# Altium schematic sheet Speisung.SchDoc: Speisung
size A4; Author: bweina; CompanyName: ICT Bbc AG; DrawnBy: bweina; Engineer: bweina; Revision: 1.0.0; SheetNumber: 2; SheetTotal: 5
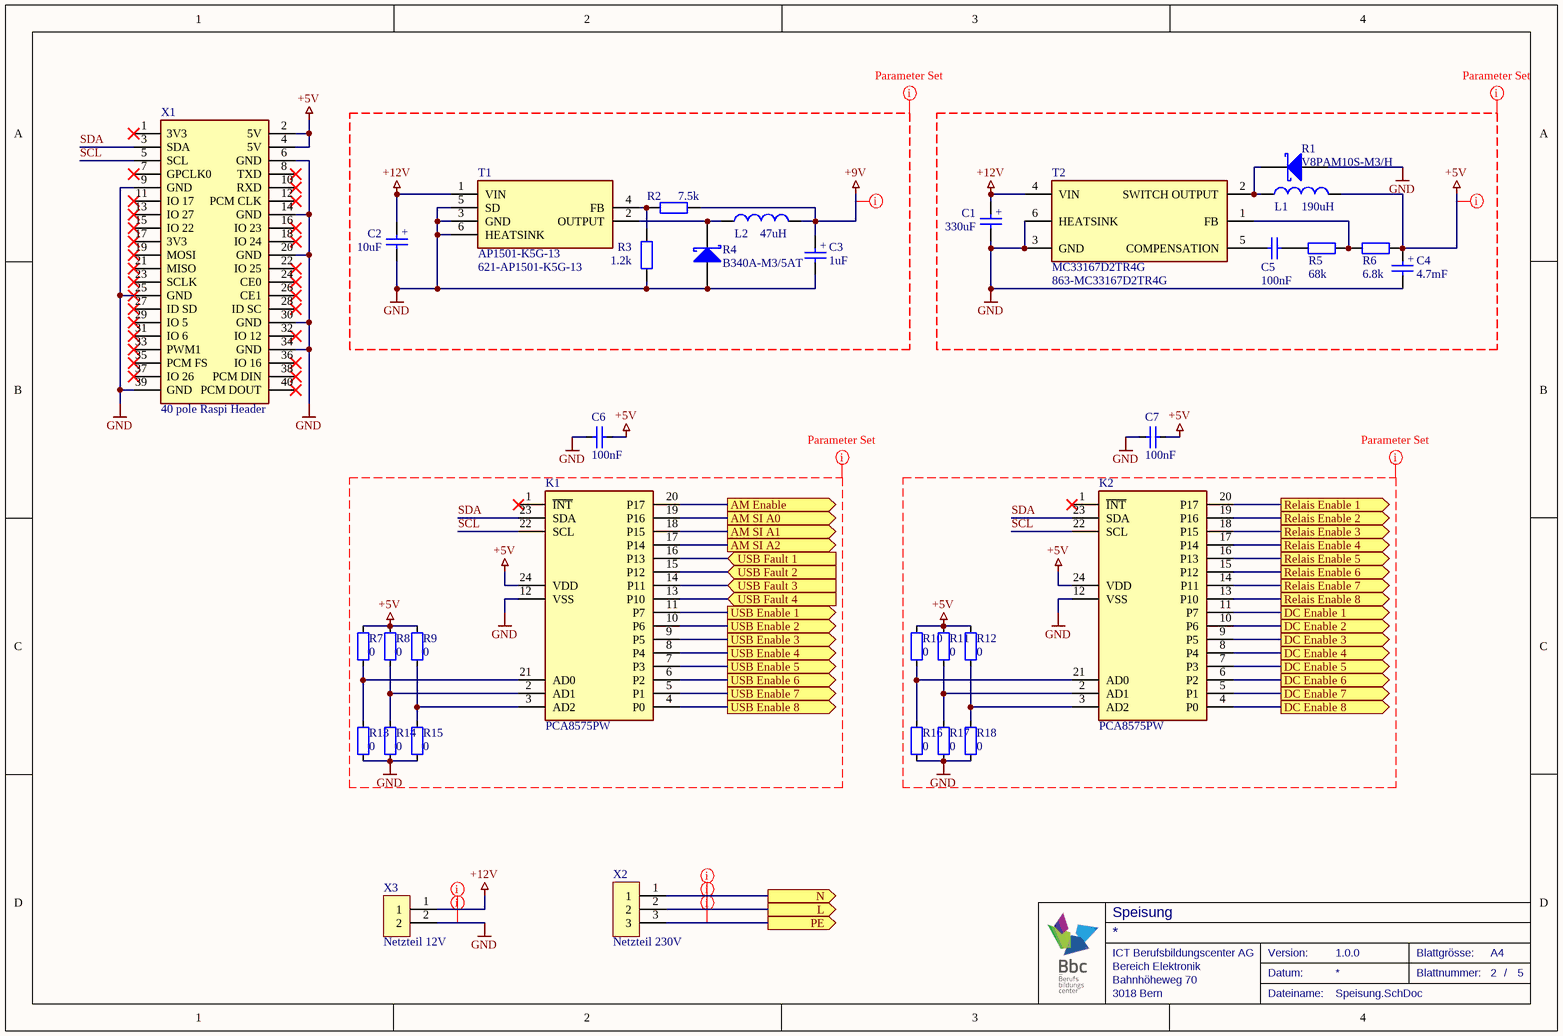
[diagram p0: Speisung.SchDoc]

## Parts
C1  value 330uF  [T521X337M016ATE015]  (hidden comment: Capacitor)
C2  value 10uF  [CAP TAN A R]  (hidden comment: Capacitor)
C3  value 1uF  [R82EC4100Z370J]  (hidden comment: Capacitor)
C4  value 4.7mF  [CAP ELKO 12.5x20x5 S]  (hidden comment: Capacitor)
C5  value 100nF  [CAP CER 1206 H]  (hidden comment: Capacitor)
C6  value 100nF  [CAP CER 0805 R]  (hidden comment: Capacitor)
C7  value 100nF  [CAP CER 0805 R]  (hidden comment: Capacitor)
K1  PCA8575PW  [TSOP65P640X110-24M]
K2  PCA8575PW  [TSOP65P640X110-24M]
L1  value 190uH  [SHBC14-1R2A0187V]  (hidden comment: Inductor)
L2  value 47uH  [SRP1038C6R8M]  (hidden comment: Inductor)
R1  V8PAM10S-M3/H  [DO-221BC]
R2  value 7.5k  [RESMELF3514N]  (hidden comment: Resistor)
R3  value 1.2k  [RESMELF3514N]  (hidden comment: Resistor)
R4  B340A-M3/5AT  [DO-214AC]
R5  value 68k  [RESMELF3514N]  (hidden comment: Resistor)
R6  value 6.8k  [RESMELF3514N]  (hidden comment: Resistor)
R7  value 0  [RES 1206 H]  (hidden comment: Resistor)
R8  value 0  [RES 1206 H]  (hidden comment: Resistor)
R9  value 0  [RES 1206 H]  (hidden comment: Resistor)
R10  value 0  [RES 1206 H]  (hidden comment: Resistor)
R11  value 0  [RES 1206 H]  (hidden comment: Resistor)
R12  value 0  [RES 1206 H]  (hidden comment: Resistor)
R13  value 0  [RES 1206 H]  (hidden comment: Resistor)
R14  value 0  [RES 1206 H]  (hidden comment: Resistor)
R15  value 0  [RES 1206 H]  (hidden comment: Resistor)
R16  value 0  [RES 1206 H]  (hidden comment: Resistor)
R17  value 0  [RES 1206 H]  (hidden comment: Resistor)
R18  value 0  [RES 1206 H]  (hidden comment: Resistor)
T1  AP1501-K5G-13  Supplier Part Number 1: 621-AP1501-K5G-13  [TO-263-5L]
T2  MC33167D2TR4G  Supplier Part Number 1: 863-MC33167D2TR4G  [TO-263-5]
X1  40 pole Raspi Header  [Header SMD Male 2x20 H]
X2  Netzteil 230V  [282841-3]
X3  Netzteil 12V  [282841-2]

## Ports
AM Enable (out), AM SI A0 (out), AM SI A1 (out), AM SI A2 (out), DC Enable 1 (out), DC Enable 2 (out), DC Enable 3 (out), DC Enable 4 (out), DC Enable 5 (out), DC Enable 6 (out), DC Enable 7 (out), DC Enable 8 (out), L (out), N (out), PE (out), Relais Enable 1 (out), Relais Enable 2 (out), Relais Enable 3 (out), Relais Enable 4 (out), Relais Enable 5 (out), Relais Enable 6 (out), Relais Enable 7 (out), Relais Enable 8 (out), USB Enable 1 (out), USB Enable 2 (out), USB Enable 3 (out), USB Enable 4 (out), USB Enable 5 (out), USB Enable 6 (out), USB Enable 7 (out), USB Enable 8 (out), USB Fault 1 (in), USB Fault 2 (in), USB Fault 3 (in), USB Fault 4 (in)

## Nets
+5V: C4.A(Anode) C6.2 C7.2 K1.24(VDD) K2.24(VDD) L1.2 R6.2 R7.2 R8.2 R9.2 R10.2 R11.2 R12.2 X1.2(5V) X1.4(5V)
+9V: C3.A(Anode) L2.2 R2.2
+12V: C1.A(Anode) C2.A(Anode) T1.1(VIN) T2.4(VIN) X3.1
GND: C1.C(Cathode) C2.C(Cathode) C3.C(Cathode) C4.C(Cathode) C6.1 C7.1 K1.12(VSS) K2.12(VSS) R1.A(Anode) R3.1 R4.A(Anode) R13.1 R14.1 R15.1 R16.1 R17.1 R18.1 T1.3(GND) T1.5(SD) T1.6(HEATSINK) T2.3(GND) T2.6(HEATSINK) X1.6(GND) X1.9(GND) X1.14(GND) X1.20(GND) X1.25(GND) X1.30(GND) X1.34(GND) X1.39(GND) X3.2
AM Enable: K1.20(P17) ; port AM Enable
AM SI A0: K1.19(P16) ; port AM SI A0
AM SI A1: K1.18(P15) ; port AM SI A1
AM SI A2: K1.17(P14) ; port AM SI A2
DC Enable 1: K2.11(P7) ; port DC Enable 1
DC Enable 2: K2.10(P6) ; port DC Enable 2
DC Enable 3: K2.9(P5) ; port DC Enable 3
DC Enable 4: K2.8(P4) ; port DC Enable 4
DC Enable 5: K2.7(P3) ; port DC Enable 5
DC Enable 6: K2.6(P2) ; port DC Enable 6
DC Enable 7: K2.5(P1) ; port DC Enable 7
DC Enable 8: K2.4(P0) ; port DC Enable 8
L: X2.2 ; port L
N: X2.1 ; port N
PE: X2.3 ; port PE
Relais Enable 1: K2.20(P17) ; port Relais Enable 1
Relais Enable 2: K2.19(P16) ; port Relais Enable 2
Relais Enable 3: K2.18(P15) ; port Relais Enable 3
Relais Enable 4: K2.17(P14) ; port Relais Enable 4
Relais Enable 5: K2.16(P13) ; port Relais Enable 5
Relais Enable 6: K2.15(P12) ; port Relais Enable 6
Relais Enable 7: K2.14(P11) ; port Relais Enable 7
Relais Enable 8: K2.13(P10) ; port Relais Enable 8
SCL: K1.22(SCL) K2.22(SCL) X1.5(SCL)
SDA: K1.23(SDA) K2.23(SDA) X1.3(SDA)
USB Enable 1: K1.11(P7) ; port USB Enable 1
USB Enable 2: K1.10(P6) ; port USB Enable 2
USB Enable 3: K1.9(P5) ; port USB Enable 3
USB Enable 4: K1.8(P4) ; port USB Enable 4
USB Enable 5: K1.7(P3) ; port USB Enable 5
USB Enable 6: K1.6(P2) ; port USB Enable 6
USB Enable 7: K1.5(P1) ; port USB Enable 7
USB Enable 8: K1.4(P0) ; port USB Enable 8
USB Fault 1: K1.16(P13) ; port USB Fault 1
USB Fault 2: K1.15(P12) ; port USB Fault 2
USB Fault 3: K1.14(P11) ; port USB Fault 3
USB Fault 4: K1.13(P10) ; port USB Fault 4
NetC5_1: C5.1 R5.1
NetC5_2: C5.2 T2.5(COMPENSATION)
NetK1_2: K1.2(AD1) R8.1 R14.2
NetK1_3: K1.3(AD2) R9.1 R15.2
NetK1_21: K1.21(AD0) R7.1 R13.2
NetK2_2: K2.2(AD1) R11.1 R17.2
NetK2_3: K2.3(AD2) R12.1 R18.2
NetK2_21: K2.21(AD0) R10.1 R16.2
NetL1_1: L1.1 R1.C(Cathode) T2.2(SWITCH_OUTPUT)
NetL2_1: L2.1 R4.C(Cathode) T1.2(OUTPUT)
NetR2_1: R2.1 R3.2 T1.4(FB)
NetR5_2: R5.2 R6.1 T2.1(FB)

Not connected (* = marked no-connect by the designer): K1 1(~{INT})*; K2 1(~{INT})*; X1 1(3V3)* 7(GPCLK0)* 8(TXD)* 10(RXD)* 11(IO_17)* 12(PCM_CLK)* 13(IO_27)* 15(IO_22)* 16(IO_23)* 17(3V3)* 18(IO_24)* 19(MOSI)* 21(MISO)* 22(IO_25)* 23(SCLK)* 24(CE0)* 26(CE1)* 27(ID_SD)* 28(ID_SC)* 29(IO_5)* 31(IO_6)* 32(IO_12)* 33(PWM1)* 35(PCM_FS)* 36(IO_16)* 37(IO_26)* 38(PCM_DIN)* 40(PCM_DOUT)*

## Layout directives
net class POWER: +5V, +9V, +12V, GND, L, N, PE

## Notes on the sheet
- Bahnhöheweg 70
- ICT Berufsbildungscenter AG
- Bereich Elektronik
- Datum:
- Version:
- Blattgrösse:
- Blattnummer:
- A4
- /
- 3018 Bern
- Dateiname:
- (in symbol Capacitor P) +

## Library data of the parts
C1-C4 = Capacitor P: Polarized Capacitor; LatestRevisionDate: 02.04.2019; Publisher: ICT Berufsbildungscenter AG
C5-C7 = Capacitor: Non polarized capacitor; LatestRevisionDate: 01.04.2019; Publisher: ICT Berufsbildungscenter AG
L1 L2 = Inductor: Type: Typ; LatestRevisionDate: 05.04.2019; Publisher: ICT Berufsbildungscenter AG
R1 R4 = Schottky Diode: LatestRevisionDate: 03.04.2019; Publisher: ICT Berufsbildungscenter AG
T1 = AP1501-K5G-13: Switching Voltage Regulators; ComponentLink1Description: New link; ComponentLink1URL: https://www.mouser.ch/ProductDetail/Diodes-Incorporated/AP1501-K5G-13?qs=%2Fha2pyFaduh7%252BHz23V2KcD1UGDob8qiicWPpp%2F%2FWUHCQ5NeehxH4og%3D%3D; Supplier 1: Mouser
T2 = MC33167D2TR4G: Switching Voltage Regulators; Manufacturer_Name: ON Semiconductor; Datasheet Link: https://www.onsemi.com/pub/Collateral/MC34167-D.PDF; Manufacturer_Part_Number: MC33167D2TR4G; Mouser Part Number: 863-MC33167D2TR4G; Mouser Price/Stock: https://www.mouser.co.uk/ProductDetail/ON-Semiconductor/MC33167D2TR4G?qs=scuLso4UvAPiI8Zw378tbw%3D%3D; Arrow Part Number: MC33167D2TR4G; Arrow Price/Stock: https://www.arrow.com/en/products/mc33167d2tr4g/on-semiconductor; Supplier 1: Mouser
X1 = RaspberryHeader40: board to board header; LatestRevisionDate: 02.05.2019; Publisher: ICT Berufsbildungscenter AG
X2 = Header 3: board to board header; LatestRevisionDate: 02.05.2019; Publisher: ICT Berufsbildungscenter AG
X3 = Header 2: board to board header; LatestRevisionDate: 02.05.2019; Publisher: ICT Berufsbildungscenter AG
R2 R3 R5-R18 = Resistor: LatestRevisionDate: 02.04.2019; Publisher: ICT Berufsbildungscenter AG